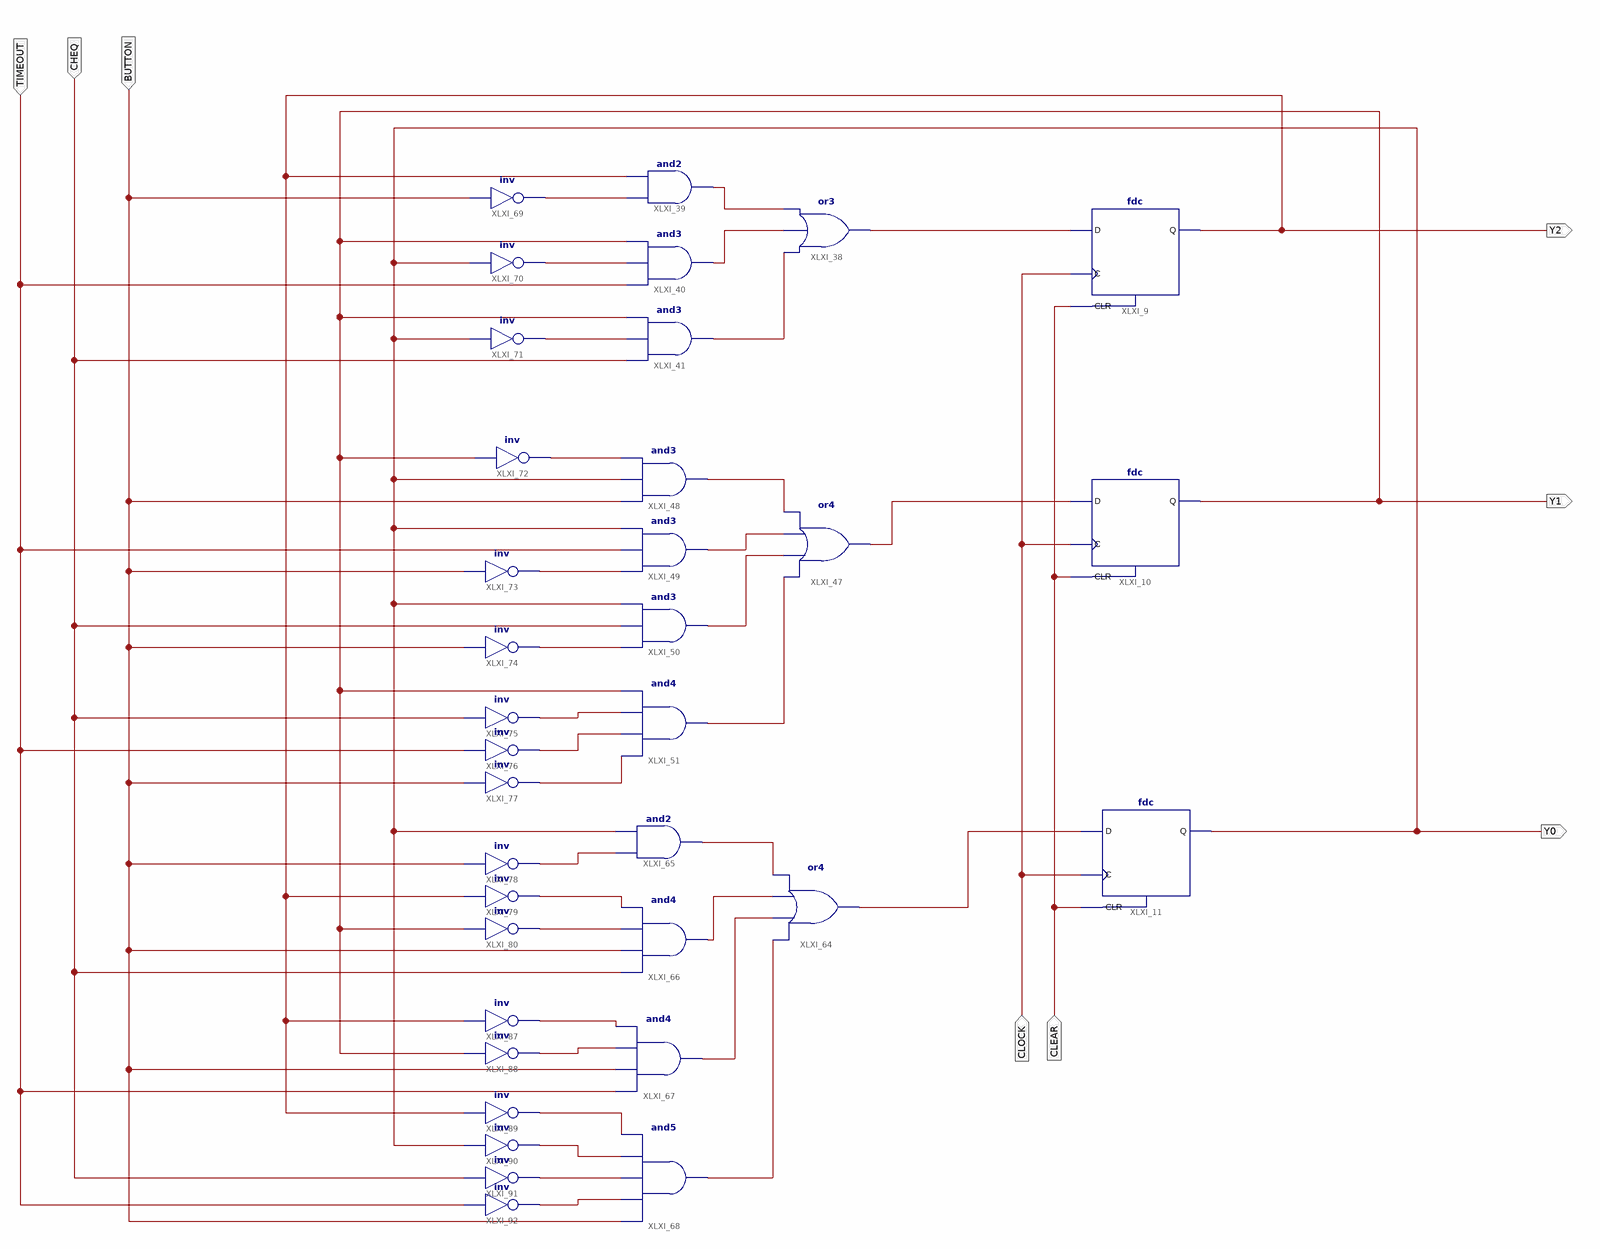
[diagram p0: schematic sheet 1]
// Xilinx ISE schematic StateMachine.sch (spartan3) as structural Verilog: 35 symbols, 8 ports
module StateMachine (
  input  TIMEOUT,
  input  CHEQ,
  input  BUTTON,
  input  CLOCK,
  input  CLEAR,
  output Y2,
  output Y1,
  output Y0
);

  wire XLXN_61, XLXN_62, XLXN_63, XLXN_64, XLXN_65, XLXN_66, XLXN_67, XLXN_68, XLXN_69, XLXN_81, XLXN_82,
       XLXN_83, XLXN_85, XLXN_86, XLXN_87, XLXN_88, XLXN_89, XLXN_90, XLXN_91, XLXN_94, XLXN_95, XLXN_96,
       XLXN_98, XLXN_100, XLXN_101, XLXN_102, XLXN_103, XLXN_104, XLXN_105, XLXN_106, XLXN_107, XLXN_108;

  fdc XLXI_9 (.C(CLOCK), .CLR(CLEAR), .D(XLXN_61), .Q(Y2));
  or XLXI_38 (XLXN_61, XLXN_64, XLXN_63, XLXN_62);
  and XLXI_39 (XLXN_62, XLXN_87, Y2);
  and XLXI_40 (XLXN_63, TIMEOUT, XLXN_88, Y1);
  and XLXI_41 (XLXN_64, CHEQ, XLXN_89, Y1);
  fdc XLXI_11 (.C(CLOCK), .CLR(CLEAR), .D(XLXN_81), .Q(Y0));
  fdc XLXI_10 (.C(CLOCK), .CLR(CLEAR), .D(XLXN_65), .Q(Y1));
  or XLXI_47 (XLXN_65, XLXN_69, XLXN_68, XLXN_67, XLXN_66);
  and XLXI_48 (XLXN_66, BUTTON, Y0, XLXN_90);
  and XLXI_49 (XLXN_67, XLXN_91, TIMEOUT, Y0);
  and XLXI_50 (XLXN_68, XLXN_94, CHEQ, Y0);
  and XLXI_51 (XLXN_69, XLXN_98, XLXN_96, XLXN_95, Y1);
  or XLXI_64 (XLXN_81, XLXN_86, XLXN_85, XLXN_83, XLXN_82);
  and XLXI_65 (XLXN_82, XLXN_102, Y0);
  and XLXI_66 (XLXN_83, CHEQ, BUTTON, XLXN_101, XLXN_100);
  and XLXI_67 (XLXN_85, TIMEOUT, BUTTON, XLXN_104, XLXN_103);
  and XLXI_68 (XLXN_86, BUTTON, XLXN_108, XLXN_107, XLXN_106, XLXN_105);
  not XLXI_69 (XLXN_87, BUTTON);
  not XLXI_70 (XLXN_88, Y0);
  not XLXI_71 (XLXN_89, Y0);
  not XLXI_72 (XLXN_90, Y1);
  not XLXI_73 (XLXN_91, BUTTON);
  not XLXI_74 (XLXN_94, BUTTON);
  not XLXI_75 (XLXN_95, CHEQ);
  not XLXI_76 (XLXN_96, TIMEOUT);
  not XLXI_77 (XLXN_98, BUTTON);
  not XLXI_79 (XLXN_100, Y2);
  not XLXI_80 (XLXN_101, Y1);
  not XLXI_78 (XLXN_102, BUTTON);
  not XLXI_87 (XLXN_103, Y2);
  not XLXI_88 (XLXN_104, Y1);
  not XLXI_89 (XLXN_105, Y2);
  not XLXI_90 (XLXN_106, Y0);
  not XLXI_91 (XLXN_107, CHEQ);
  not XLXI_92 (XLXN_108, TIMEOUT);
endmodule
